# EAGLE board design (EAGLE 7.3.0), part 1 of 2
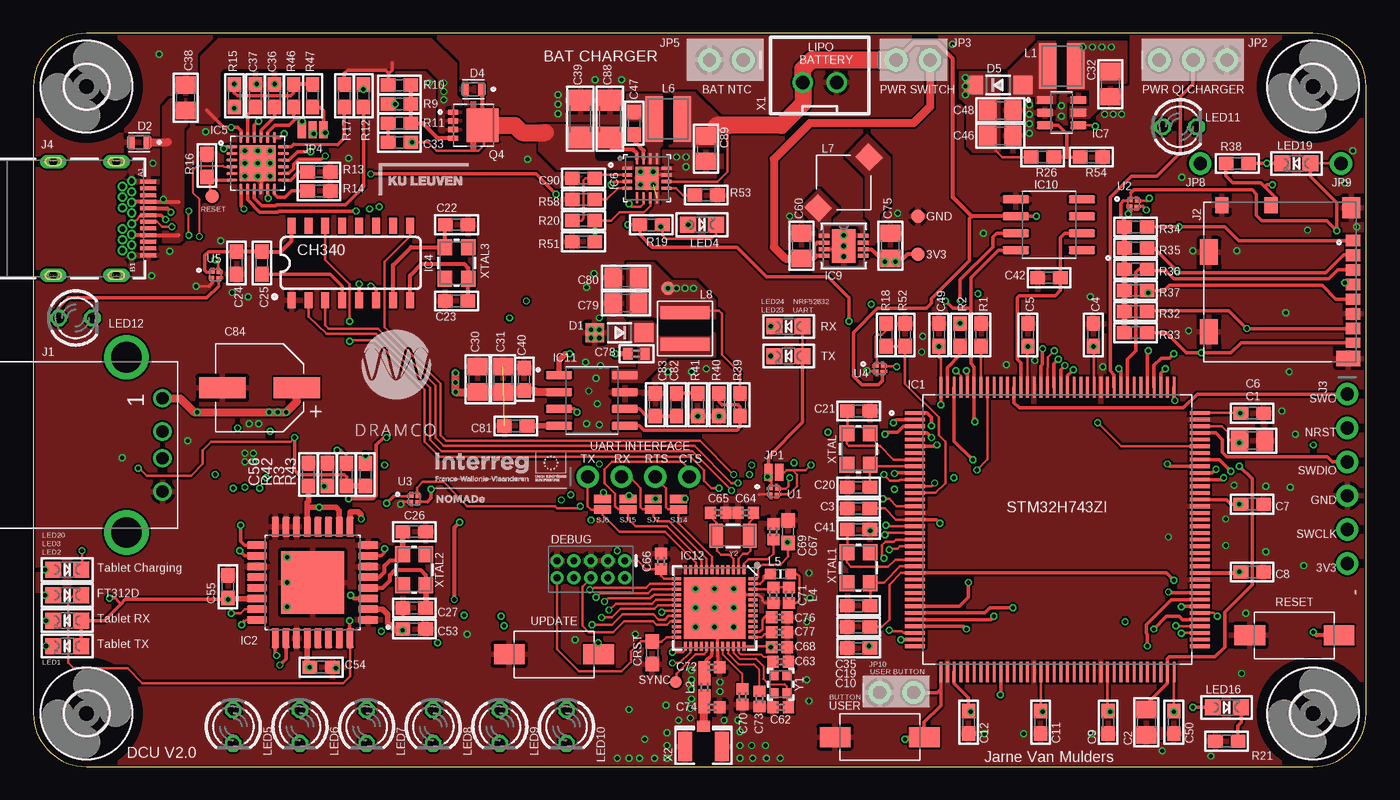
[diagram p7: board, top side]
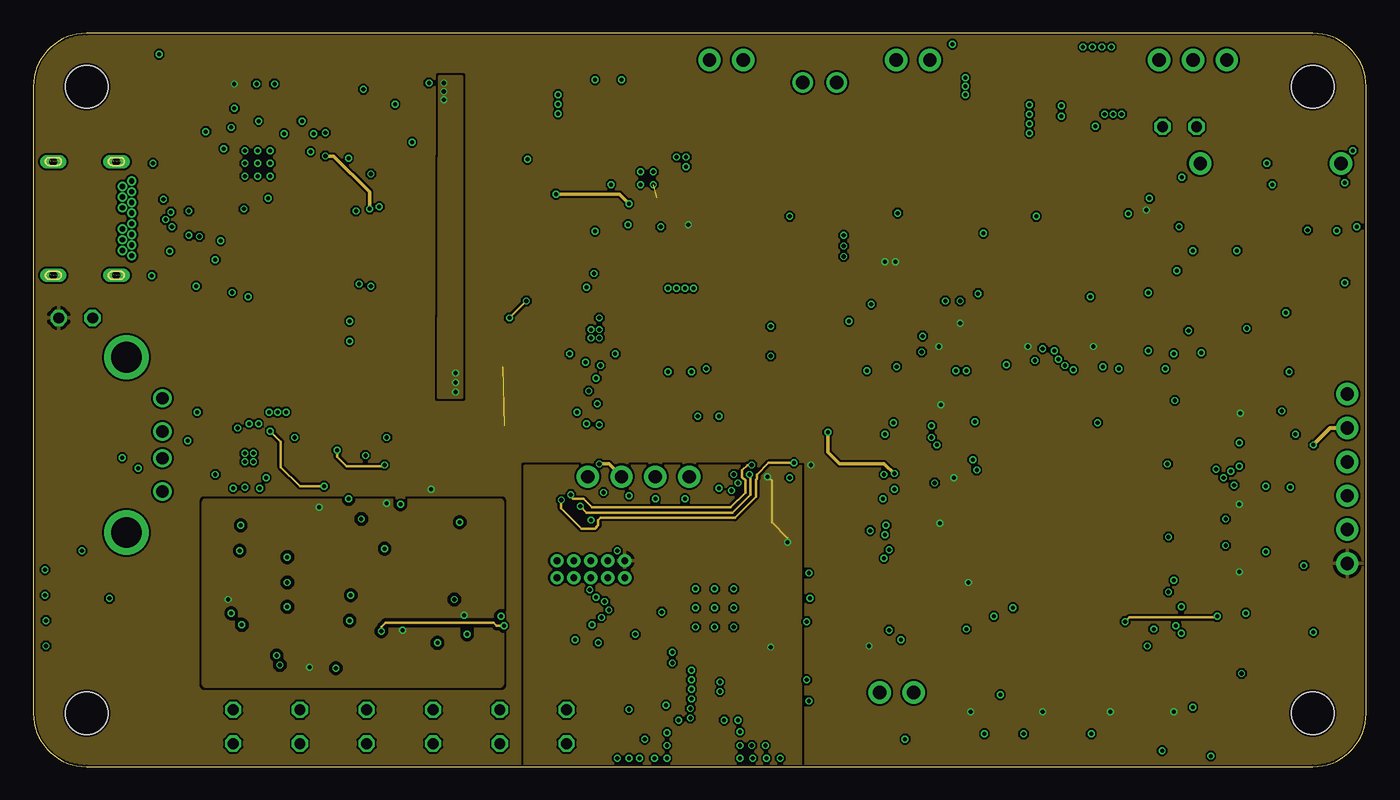
[diagram p8: board, inner layer Route2]
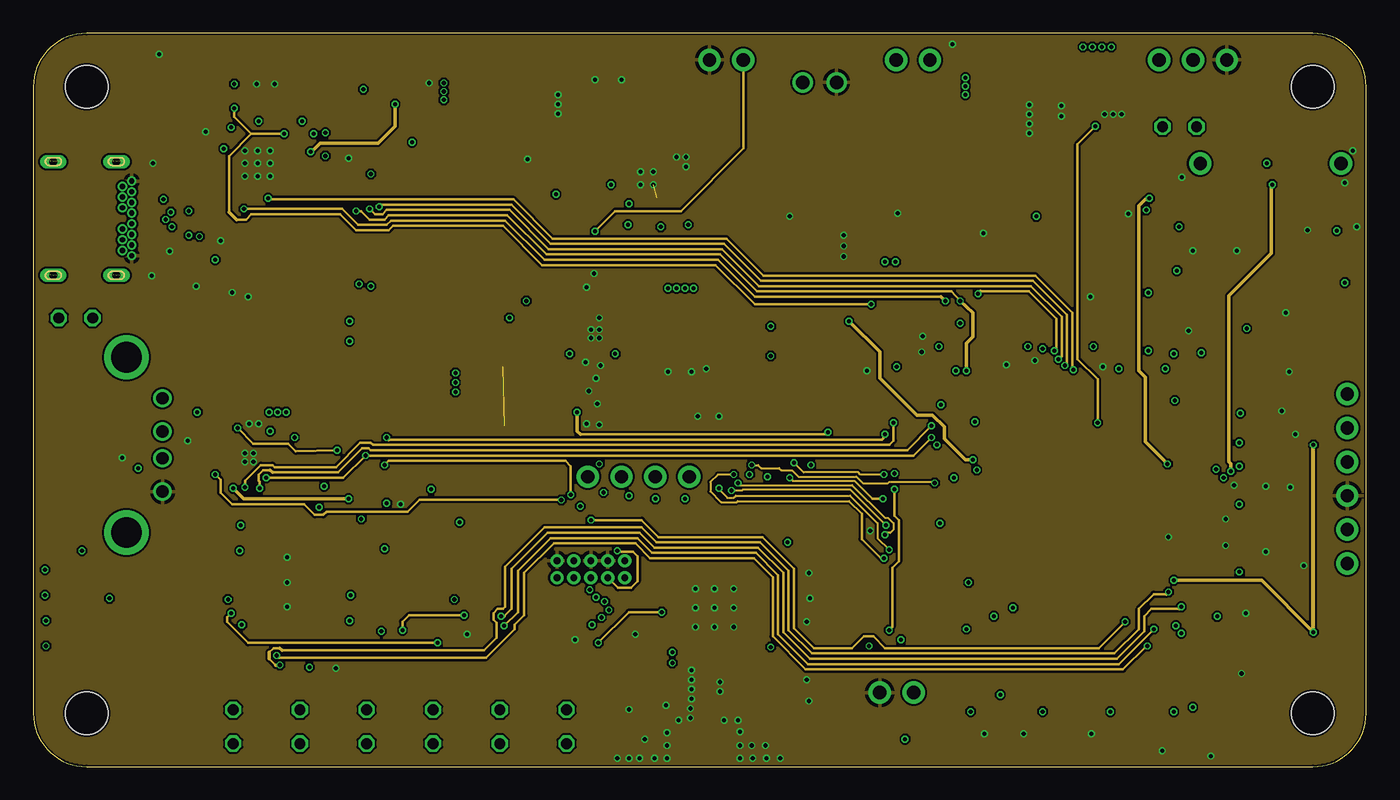
[diagram p9: board, inner layer Route3]
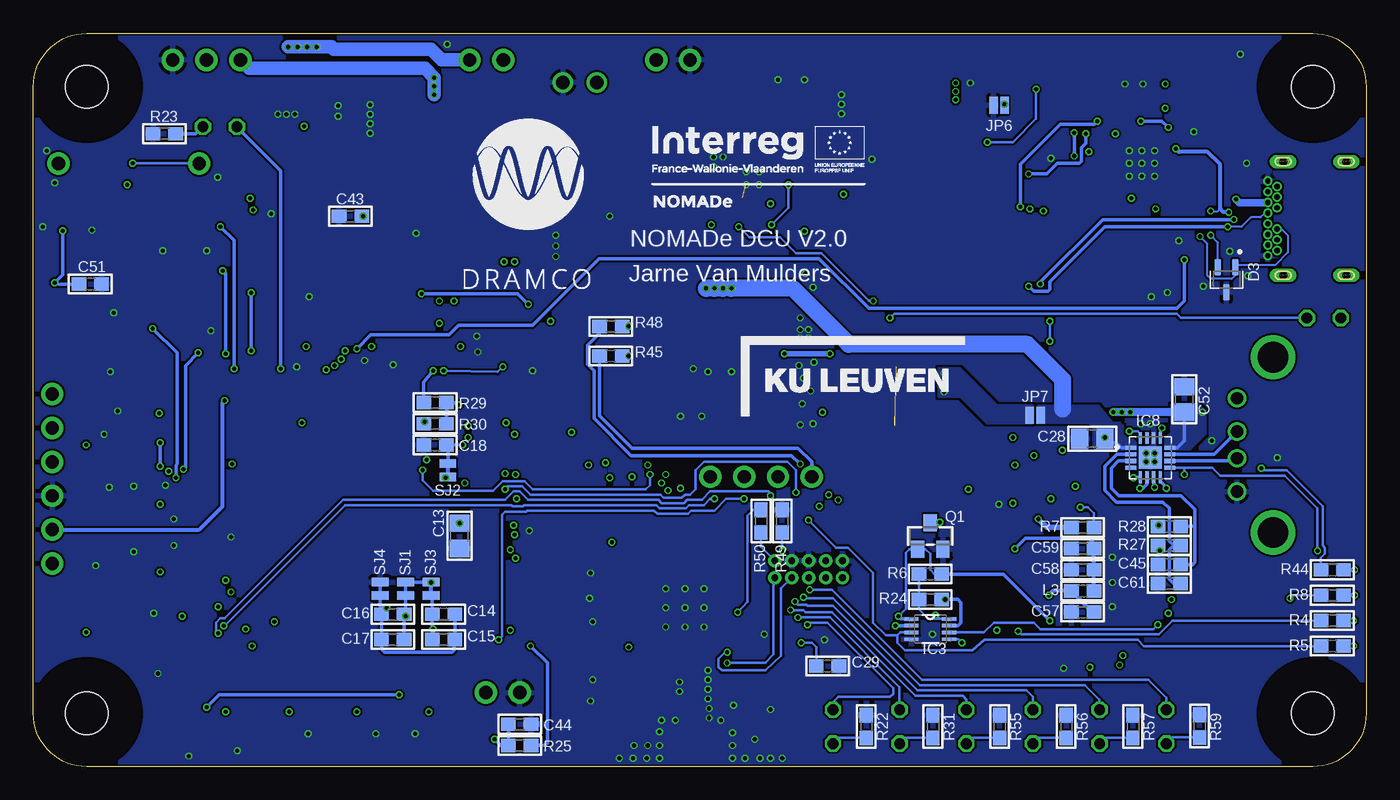
[diagram p10: board, bottom side, seen from below]

Size 100 x 55 mm. Coordinates in mm from the lower left corner, seen from the top.
Outline: 0,51 0,4 arc90 4,0 96,0 arc90 100,4 100,51 arc90 96,55 4,55 arc90 0,51
Copper layers (1*2*3*16): Top 0.035mm / dielectric 0.2mm / Route2 0.0175mm / dielectric 0.3mm / Route3 0.035mm / dielectric 0.2mm / Bottom 0.035mm
Design rules "SeeedStudio_4layer_DRU_no_angle_20140221 *": minimum track width 4mil, minimum drill 12mil, track to track 6mil, track to pad 6mil, pad to pad 3mil, via to via 6mil, smd to smd 0mil, copper to edge 4mil, drill to drill 8mil, minimum pad ring 6mil, minimum via ring 4mil, stop-mask expansion 4mil, vias tented up to drill 100mil, thermal gap 10mil

## Footprints (pad centres in the part's own frame; a part is rotated, then mirrored left to right if it is on the bottom)
0805 = smd 1.3 x 1.5: 1 -0.95,0; 2 0.95,0
0603 = smd 1.1 x 1: 1 -0.85,0; 2 0.85,0
1206 = smd 1.6 x 1.8: 1 -1.4,0; 2 1.4,0
0402 = smd 0.85 x 0.9: 1 -0.58,0; 2 0.58,0
0402' = smd 0.7 x 0.9: 1 -0.65,0; 2 0.65,0
3.5X1.6X2.1(BXCXA) = smd 3.5 x 1.6: 1 2.8,0; 2 -2.8,0
C0603 = smd 1.1 x 1: 1 -0.85,0; 2 0.85,0
SOD-123 = smd 1.4 x 1.4: A 1.85,0; C -1.85,0
TVS_ESDA25P35-1U1M = smd 0.55 x 0.8: A 0.625,0; C -0.625,0
SOT65P210X110-3N = smd 1.23 x 0.5: 1 -0.94,0.65; 2 -0.94,-0.65; 3 0.94,0
2X5-PTH-1.27MM = drill 0.508 pad 1: 1 -2.54,-0.635; 2 -2.54,0.635; 3 -1.27,-0.635; 4 -1.27,0.635; 5 0,-0.635; 6 0,0.635; 7 1.27,-0.635; 8 1.27,0.635; 9 2.54,-0.635; 10 2.54,0.635
3,2 = hole 3.2: 0,0
QFP50P2200X2200X160-144N = smd 1.56 x 0.28: 1 -10.68,8.75; 2 -10.68,8.25; 3 -10.68,7.75; 4 -10.68,7.25; 5 -10.68,6.75; 6 -10.68,6.25; 7 -10.68,5.75; 8 -10.68,5.25; 9 -10.68,4.75; 10 -10.68,4.25; 11 -10.68,3.75; 12 -10.68,3.25; 13 -10.68,2.75; 14 -10.68,2.25; 15 -10.68,1.75; 16 -10.68,1.25; 17 -10.68,0.75; 18 -10.68,0.25; 19 -10.68,-0.25; 20 -10.68,-0.75; 21 -10.68,-1.25; 22 -10.68,-1.75; 23 -10.68,-2.25; 24 -10.68,-2.75; 25 -10.68,-3.25; 26 -10.68,-3.75; 27 -10.68,-4.25; 28 -10.68,-4.75; 29 -10.68,-5.25; 30 -10.68,-5.75; 31 -10.68,-6.25; 32 -10.68,-6.75; 33 -10.68,-7.25; 34 -10.68,-7.75; 35 -10.68,-8.25; 36 -10.68,-8.75; 73 10.68,-8.75; 74 10.68,-8.25; 75 10.68,-7.75; 76 10.68,-7.25; 77 10.68,-6.75; 78 10.68,-6.25; 79 10.68,-5.75; 80 10.68,-5.25; 81 10.68,-4.75; 82 10.68,-4.25; 83 10.68,-3.75; 84 10.68,-3.25; 85 10.68,-2.75; 86 10.68,-2.25; 87 10.68,-1.75; 88 10.68,-1.25; 89 10.68,-0.75; 90 10.68,-0.25; 91 10.68,0.25; 92 10.68,0.75; 93 10.68,1.25; 94 10.68,1.75; 95 10.68,2.25; 96 10.68,2.75; 97 10.68,3.25; 98 10.68,3.75; 99 10.68,4.25; 100 10.68,4.75; 101 10.68,5.25; 102 10.68,5.75; 103 10.68,6.25; 104 10.68,6.75; 105 10.68,7.25; 106 10.68,7.75; 107 10.68,8.25; 108 10.68,8.75 | smd 0.28 x 1.56: 37 -8.75,-10.68; 38 -8.25,-10.68; 39 -7.75,-10.68; 40 -7.25,-10.68; 41 -6.75,-10.68; 42 -6.25,-10.68; 43 -5.75,-10.68; 44 -5.25,-10.68; 45 -4.75,-10.68; 46 -4.25,-10.68; 47 -3.75,-10.68; 48 -3.25,-10.68; 49 -2.75,-10.68; 50 -2.25,-10.68; 51 -1.75,-10.68; 52 -1.25,-10.68; 53 -0.75,-10.68; 54 -0.25,-10.68; 55 0.25,-10.68; 56 0.75,-10.68; 57 1.25,-10.68; 58 1.75,-10.68; 59 2.25,-10.68; 60 2.75,-10.68; 61 3.25,-10.68; 62 3.75,-10.68; 63 4.25,-10.68; 64 4.75,-10.68; 65 5.25,-10.68; 66 5.75,-10.68; 67 6.25,-10.68; 68 6.75,-10.68; 69 7.25,-10.68; 70 7.75,-10.68; 71 8.25,-10.68; 72 8.75,-10.68; 109 8.75,10.68; 110 8.25,10.68; 111 7.75,10.68; 112 7.25,10.68; 113 6.75,10.68; 114 6.25,10.68; 115 5.75,10.68; 116 5.25,10.68; 117 4.75,10.68; 118 4.25,10.68; 119 3.75,10.68; 120 3.25,10.68; 121 2.75,10.68; 122 2.25,10.68; 123 1.75,10.68; 124 1.25,10.68; 125 0.75,10.68; 126 0.25,10.68; 127 -0.25,10.68; 128 -0.75,10.68; 129 -1.25,10.68; 130 -1.75,10.68; 131 -2.25,10.68; 132 -2.75,10.68; 133 -3.25,10.68; 134 -3.75,10.68; 135 -4.25,10.68; 136 -4.75,10.68; 137 -5.25,10.68; 138 -5.75,10.68; 139 -6.25,10.68; 140 -6.75,10.68; 141 -7.25,10.68; 142 -7.75,10.68; 143 -8.25,10.68; 144 -8.75,10.68
QFP80P900X900X160-32N = smd 1.49 x 0.55: 1 -4.17,2.8; 2 -4.17,2; 3 -4.17,1.2; 4 -4.17,0.4; 5 -4.17,-0.4; 6 -4.17,-1.2; 7 -4.17,-2; 8 -4.17,-2.8; 17 4.17,-2.8; 18 4.17,-2; 19 4.17,-1.2; 20 4.17,-0.4; 21 4.17,0.4; 22 4.17,1.2; 23 4.17,2; 24 4.17,2.8 | smd 0.55 x 1.49: 9 -2.8,-4.17; 10 -2,-4.17; 11 -1.2,-4.17; 12 -0.4,-4.17; 13 0.4,-4.17; 14 1.2,-4.17; 15 2,-4.17; 16 2.8,-4.17; 25 2.8,4.17; 26 2,4.17; 27 1.2,4.17; 28 0.4,4.17; 29 -0.4,4.17; 30 -1.2,4.17; 31 -2,4.17; 32 -2.8,4.17 | smd 4.7 x 4.7: 33 0,0
SOP50P310X90-8N = smd 1.067 x 0.254: 1 -1.422,0.762; 2 -1.422,0.254; 3 -1.422,-0.254; 4 -1.422,-0.762; 5 1.422,-0.762; 6 1.422,-0.254; 7 1.422,0.254; 8 1.422,0.762
SO016 = smd 0.6 x 1.2: 1 -4.445,-2.8; 2 -3.175,-2.8; 3 -1.905,-2.8; 4 -0.635,-2.8; 5 0.635,-2.8; 6 1.905,-2.8; 7 3.175,-2.8; 8 4.445,-2.8; 9 4.445,2.8; 10 3.175,2.8; 11 1.905,2.8; 12 0.635,2.8; 13 -0.635,2.8; 14 -1.905,2.8; 15 -3.175,2.8; 16 -4.445,2.8
QFN50P400X400X90-25N = smd 0.84 x 0.26: 1 -1.93,1.25; 2 -1.93,0.75; 3 -1.93,0.25; 4 -1.93,-0.25; 5 -1.93,-0.75; 6 -1.93,-1.25; 13 1.93,-1.25; 14 1.93,-0.75; 15 1.93,-0.25; 16 1.93,0.25; 17 1.93,0.75; 18 1.93,1.25 | smd 0.26 x 0.84: 7 -1.25,-1.93; 8 -0.75,-1.93; 9 -0.25,-1.93; 10 0.25,-1.93; 11 0.75,-1.93; 12 1.25,-1.93; 19 1.25,1.93; 20 0.75,1.93; 21 0.25,1.93; 22 -0.25,1.93; 23 -0.75,1.93; 24 -1.25,1.93 | smd 2.7 x 2.7: 25 0,0
QFN50P350X350X100-21N = smd 0.8 x 0.23: 1 -1.475,0.75; 2 -1.475,0.25; 3 -1.475,-0.25; 4 -1.475,-0.75; 9 1.475,-0.75; 10 1.475,-0.25; 11 1.475,0.25; 12 1.475,0.75 | smd 0.23 x 0.8: 5 -0.75,-1.475; 6 -0.25,-1.475; 7 0.25,-1.475; 8 0.75,-1.475; 13 0.75,1.475; 14 0.25,1.475; 15 -0.25,1.475; 16 -0.75,1.475 | smd 1.7 x 1.7: 17 0,0
SOT95P280X145-6N = smd 1.21 x 0.58: 1 -1.255,0.95; 2 -1.255,0; 3 -1.255,-0.95; 4 1.255,-0.95; 5 1.255,0; 6 1.255,0.95
QFN50P300X300X80-17N = smd 0.83 x 0.26: 1 -1.47,0.75; 2 -1.47,0.25; 3 -1.47,-0.25; 4 -1.47,-0.75; 9 1.47,-0.75; 10 1.47,-0.25; 11 1.47,0.25; 12 1.47,0.75 | smd 0.26 x 0.83: 5 -0.75,-1.47; 6 -0.25,-1.47; 7 0.25,-1.47; 8 0.75,-1.47; 13 0.75,1.47; 14 0.25,1.47; 15 -0.25,1.47; 16 -0.75,1.47 | smd 1.7 x 1.7: 17 0,0
DFN-8_DD = smd 0.787 x 0.305: 1 -1.46,0.75; 2 -1.46,0.25; 3 -1.46,-0.25; 4 -1.46,-0.75; 5 1.46,-0.75; 6 1.46,-0.25; 7 1.46,0.25; 8 1.46,0.75 | smd 1.753 x 2.489: 9 0,0
SOIC127P600X175-8N = smd 1.97 x 0.59: 1 -2.475,1.905; 2 -2.475,0.635; 3 -2.475,-0.635; 4 -2.475,-1.905; 5 2.475,-1.905; 6 2.475,-0.635; 7 2.475,0.635; 8 2.475,1.905
SOIC127P599X175-8N = smd 1.97 x 0.6: 1 -2.47,1.905; 2 -2.47,0.635; 3 -2.47,-0.635; 4 -2.47,-1.905; 5 2.47,-1.905; 6 2.47,-0.635; 7 2.47,0.635; 8 2.47,1.905
QFN48-6X6MM = smd 0.68 x 0.23: 1 -2.86,2.2; 2 -2.86,1.8; 3 -2.86,1.4; 4 -2.86,1; 5 -2.86,0.6; 6 -2.86,0.2; 7 -2.86,-0.2; 8 -2.86,-0.6; 9 -2.86,-1; 10 -2.86,-1.4; 11 -2.86,-1.8; 12 -2.86,-2.2; 25 2.86,-2.2; 26 2.86,-1.8; 27 2.86,-1.4; 28 2.86,-1; 29 2.86,-0.6; 30 2.86,-0.2; 31 2.86,0.2; 32 2.86,0.6; 33 2.86,1; 34 2.86,1.4; 35 2.86,1.8; 36 2.86,2.2 | smd 0.23 x 0.68: 13 -2.2,-2.86; 14 -1.8,-2.86; 15 -1.4,-2.86; 16 -1,-2.86; 17 -0.6,-2.86; 18 -0.2,-2.86; 19 0.2,-2.86; 20 0.6,-2.86; 21 1,-2.86; 22 1.4,-2.86; 23 1.8,-2.86; 24 2.2,-2.86; 37 2.2,2.86; 38 1.8,2.86; 39 1.4,2.86; 40 1,2.86; 41 0.6,2.86; 42 0.2,2.86; 43 -0.2,2.86; 44 -0.6,2.86; 45 -1,2.86; 46 -1.4,2.86; 47 -1.8,2.86; 48 -2.2,2.86 | smd 4.6 x 4.6: EP 0,0
614004190021 = drill 0.92: 1 -3.5,2.71; 2 -1,2.71; 3 1,2.71; 4 3.5,2.71 | drill 2.3: SHELL -6.57,0; SHELL1 6.57,0
MOLEX_104031-0811 = smd 0.85 x 1.1: 1 3.105,-5.2; 3 0.905,-5.2; 4 -0.195,-5.2; 5 -1.295,-5.2; 6 -2.395,-5.2; 7 -3.495,-5.2 | smd 0.875 x 1.1: 2 2.005,-5.2 | smd 0.75 x 1.1: 8 -4.545,-5.2 | smd 1.2 x 1: 9 5.74,0.95; 10 5.74,4.65 | smd 1.55 x 1.35: G1 5.565,-5.075 | smd 1.17 x 1.8: G2 -5.755,-4.85 | smd 1.9 x 1.35: G3 -3.73,5.625; G4 2.24,5.625
1X06_ROUND = drill 1 pad 1.676: 1 -6.35,0; 2 -3.81,0; 3 -1.27,0; 4 1.27,0; 5 3.81,0; 6 6.35,0
632723100011 = smd 0.3 x 1.2: A1 -2.75,5.93; A2 -2.25,5.93; A3 -1.75,5.93; A4 -1.25,5.93; A5 -0.75,5.93; A6 -0.25,5.93; A7 0.25,5.93; A8 0.75,5.93; A9 1.25,5.93; A10 1.75,5.93; A11 2.25,5.93; A12 2.75,5.93 | drill 0.4 pad 0.65: B1 2.8,4.68; B2 2.4,3.98; B3 1.6,3.98; B4 1.2,4.68; B5 0.8,3.98; B6 0.4,4.68; B7 -0.4,4.68; B8 -0.8,3.98; B9 -1.2,4.68; B10 -1.6,3.98; B11 -2.4,3.98; B12 -2.8,4.68; GND 2,4.68; GND1 -2,4.68 | drill 0.6 pad 1 long: S1 -4.27,3.53; S2 4.27,3.53; S3 4.27,-1.2; S4 -4.27,-1.2
SMT-JUMPER_2_NO_NO-SILK = smd 0.635 x 1.27: 1 -0.406,0; 2 0.406,0
1X03_ROUND = drill 1 pad 1.676: 1 -2.54,0; 2 0,0; 3 2.54,0
1X02_ROUND = drill 1 pad 1.676: 1 -1.27,0; 2 1.27,0
SMT-JUMPER_3_NO_NO-SILK = smd 0.635 x 1.27: 1 -0.813,0; 2 0,0; 3 0.813,0
1X01_ROUND = drill 1 pad 1.676: 1 0,0
WE-MAIA_3020 = smd 1.3 x 3.4: 1 -1.05,0; 2 1.05,0
_0603MP = smd 0.8 x 0.8: 1 -0.762,0; 2 0.762,0
MSS4020 = smd 1.499 x 1.397 rotated 45: 1 -1.905,1.905; 2 1.905,-1.905
WE-MAIA_4030 = smd 0.98 x 3.7: 1 -1.185,0; 2 1.185,0
CHIPLED_0805 = smd 1.2 x 1.2: A 0,-1.05; C 0,1.05
LED3MM = drill 0.813 octagon: A -1.27,0; K 1.27,0
SOT23-WIDE = smd 1 x 1.27: 1 -0.95,-1; 2 0.95,-1; 3 0,1
TRANS_STL6P3LLH6 = smd 0.75 x 0.4: 1 -1.525,0.975; 2 -1.525,0.325; 3 -1.525,-0.325; 4 -1.525,-0.975 | smd 2.4 x 2.45: 5_8 0.7,0
434111043826 = smd 2.3 x 1.5: 1 -3.35,0; 2 3.35,0
SMT-JUMPER_2_NC_TRACE_NO-SILK = smd 0.635 x 1.27: 1 -0.508,0; 2 0.508,0
TP09R = smd 0.9 x 0.9: TP 0,0
TP10R = smd 1 x 1: TP 0,0
IC_MIC94081YFT-TR = smd 0.2 x 0.2: 1 -0.2,0.2; 2 -0.2,-0.2; 3 0.2,-0.2; 4 0.2,0.2
1X04_ROUND = drill 1 pad 1.676: 1 -3.81,0; 2 -1.27,0; 3 1.27,0; 4 3.81,0
JST-XH-02-PACKAGE-ROUND-PAD = drill 1.016: 1 -1.27,0; 2 1.27,0
U.FL = smd 2.2 x 1.05: 1 0,1.375; 2 0,-1.375 | smd 0.8 x 1: 3 1.525,0
CRYSTAL-SMD-3.2X2.5MM = smd 1.2 x 1.1: 1 -1.175,-0.875; 2 1.175,-0.875; 3 1.175,0.875; 4 -1.175,0.875
CRYSTAL-SMD-2.0X1.6MM = smd 0.75 x 0.7: 1 -0.675,-0.5; 2 0.675,-0.5; 3 0.675,0.5; 4 -0.675,0.5
CRYSTAL-SMD-3.2X1.5MM = smd 1 x 1.8: P$1 -1.25,0; P$2 1.25,0

## Placement (x,y rotation side)
C1  2u2  [0805]  91.44,24.45 0 top
C2  2u2  [0805]  83.5,3.33 270 top
C3  100n  [0603]  61.91,19.37 180 top
C4  100n  [0603]  79.53,32.38 90 top
C5  100n  [0603]  74.61,32.38 90 top
C6  100n  [0603]  91.44,26.51 0 top
C7  100n  [0603]  91.44,19.68 0 top
C8  100n  [0603]  91.44,14.61 0 top
C9  100n  [0603]  80.64,3.33 270 top
C10  100n  [0603]  61.91,8.89 180 top
C11  100n  [0603]  75.56,3.33 270 top
C12  100n  [0603]  70.17,3.33 270 top
C13  10u  [0805]  68.02,17.3 270 bottom
C14  1u  [0603]  69.22,11.43 0 bottom
C15  100n  [0603]  69.22,9.53 0 bottom
C16  1u  [0603]  73.03,11.43 180 bottom
C17  100n  [0603]  73.03,9.53 180 bottom
C18  1u  [0603]  69.85,24.13 180 bottom
C19  100n  [0603]  61.91,10.48 180 top
C20  15pF  [0603]  61.91,20.95 180 top
C21  15pF  [0603]  61.91,26.67 0 top
C22  22p  [0603]  31.75,40.64 0 top
C23  22p  [0603]  31.75,34.92 180 top
C24  100n  [0603]  15.24,37.78 270 top
C25  100n  [0603]  17.14,37.78 270 top
C26  22p  [0603]  28.57,17.62 0 top
C27  22p  [0603]  28.57,11.91 180 top
C28  10u  [0805]  20.56,24.61 180 bottom
C29  100n  [0603]  40.4,7.54 0 bottom
C30  10u  [0805]  33.34,29.05 90 top
C31  10u  [0805]  35.24,29.05 90 top
C32  10u  [0805]  80.8,51.2 270 top
C33  100n  [0603]  27.46,46.83 180 top
C35  [0603]  61.91,12.06 180 top
C36  1u  [0603]  18.1,50.32 90 top
C37  1u  [0603]  16.67,50.32 90 top
C38  1u  [0805]  11.43,50.16 90 top
C39  10u  [1206]  41.04,48.58 90 top
C40  100n  [0603]  36.83,29.05 90 top
C41  [0603]  61.91,17.78 0 top
C42  100n  [0603]  76.2,36.67 180 top
C43  100n  [0603]  76.2,41.27 0 bottom
C44  100n  [0603]  63.5,3.17 0 bottom
C45  47p  [0603]  14.76,15.16 180 bottom
C46  10u  [0805]  72.55,47.31 0 top
C47  47n  [0603]  45.09,48.26 270 top
C48  10u  [0805]  72.55,49.21 0 top
C49  100n  [0603]  67.94,32.38 90 top
C50  100n  [0603]  85.57,3.33 270 top
C51  100n  [0603]  95.73,36.2 0 bottom
C52  10u  [0805]  13.65,27.54 90 bottom
C53  100n  [0603]  28.57,10.32 0 top
C54  100n  [0603]  21.59,7.46 0 top
C55  100n  [0603]  14.61,13.49 90 top
C56  100n  [0603]  20.64,21.91 90 top
C57  100n  [0603]  21.27,11.59 180 bottom
C58  100n  [0603]  21.27,14.76 180 bottom
C59  4u7  [0603]  21.27,16.35 180 bottom
C60  10u  [0805]  57.63,39.05 90 top
C61  47p  [0603]  14.76,13.73 180 bottom
C62  6pF  [0402]  56.07,4.45 0 top
C63  6pF  [0402]  56.07,7.86 0 top
C64  15pF  [0402]  53.45,19.05 0 top
C65  15pF  [0402]  51.39,19.05 180 top
C66  0.1uF  [0402]  47.1,15.4 90 top
C67  4.7uF  [0603]  56.63,17.62 90 top
C68  0.1uF  [0402]  55.99,8.97 0 top
C69  0.1uF  [0402]  55.52,17.62 270 top
C70  DNP  [0402]  53.21,5.24 90 top
C71  1.0uF  [0402]  55.52,12.86 90 top
C72  0.8pF  [0402]  50.91,7.46 180 top
C73  100pF  [0402]  54.48,5.08 90 top
C74  DNP  [0402]  50.91,4.45 0 top
C75  10u  [0805]  64.29,39.05 90 top
C76  12p  [0402]  55.99,11.19 180 top
C77  12p  [0402]  55.99,10.08 180 top
C78  100n  [0402']  45.24,30.96 180 top
C79  22u  [0805]  44.45,34.77 180 top
C80  22u  [0805]  44.45,36.67 180 top
C81  100n  [0603]  36.2,25.56 180 top
C82  1n  [0603]  48.26,27.15 90 top
C83  47p  [0603]  46.67,27.15 90 top
C84  150uF  [3.5X1.6X2.1(BXCXA)]  16.99,28.42 0 top
C88  10u  [1206]  43.26,48.58 90 top
C89  10u  [0805]  50.48,46.35 270 top
C90  2u2  [0603]  41.27,44.13 180 top
CRST  100n  [C0603]  46.43,8.54 270 top
D1  PMEG3020EGWX  [SOD-123]  43.97,32.54 180 top
D2  ESDA25P35-1U1M  [TVS_ESDA25P35-1U1M]  7.94,46.83 180 top
D3  ESDA25W  [SOT65P210X110-3N]  10.48,36.51 270 bottom
D4  ESDA25P35-1U1M  [TVS_ESDA25P35-1U1M]  33.02,50.8 180 top
D5  PMEG3020EGWX  [SOD-123]  72.39,51.12 0 top
DEBUG  CORTEX_DEBUGPTH  [2X5-PTH-1.27MM]  41.83,14.8 180 top
H1  MOUNT-HOLE3.2  [3,2]  4,4 0 top
H2  MOUNT-HOLE3.2  [3,2]  96,4 0 top
H3  MOUNT-HOLE3.2  [3,2]  96,51 0 top
H4  MOUNT-HOLE3.2  [3,2]  4,51 0 top
IC1  STM32H743ZIT6  [QFP50P2200X2200X160-144N]  76.83,17.78 0 top
IC2  FT312D  [QFP80P900X900X160-32N]  20.95,13.81 180 top
IC3  SN74LVC2G241DCUT  [SOP50P310X90-8N]  32.7,10.32 0 bottom
IC4  CH340G  [SO016]  23.81,37.78 0 top
IC5  STUSB4500QTR  [QFN50P400X400X90-25N]  16.83,45.24 0 top
IC6  BQ25300  [QFN50P350X350X100-21N]  46.04,44.13 0 top
IC7  TLV61048DBVT  [SOT95P280X145-6N]  77.15,49.05 0 top
IC8  STCC2540  [QFN50P300X300X80-17N]  16.19,23.18 0 bottom
IC9  LTC3531EDDPBF  [DFN-8_DD]  60.8,39.05 0 top
IC10  DS3231MZ+TRL  [SOIC127P600X175-8N]  76.2,40.64 180 top
IC11  TPS54331D  [SOIC127P599X175-8N]  41.91,27.46 0 top
IC12  NRF52832  [QFN48-6X6MM]  51.12,11.91 270 top
J1  [614004190021]  6.99,24.13 270 top
J2  104031-0811  [MOLEX_104031-0811]  93.82,36.35 90 top
J3  SWD  [1X06_ROUND]  98.58,21.59 270 top
J4  632723100011  [632723100011]  2.7,41.12 270 top
JP1  JUMPER-SMT_2_NO_NO-SILK  [SMT-JUMPER_2_NO_NO-SILK]  55.56,22.07 180 top
JP2  [1X03_ROUND]  87,53 0 top
JP3  [1X02_ROUND]  66,53 0 top
JP4  JUMPER-SMT_3_NO_NO-SILK  [SMT-JUMPER_3_NO_NO-SILK]  20.95,47.78 180 top
JP5  [1X02_ROUND]  52,53 180 top
JP6  JUMPER-SMT_2_NO_NO-SILK  [SMT-JUMPER_2_NO_NO-SILK]  27.54,49.61 180 bottom
JP7  JUMPER-SMT_2_NO_NO-SILK  [SMT-JUMPER_2_NO_NO-SILK]  24.84,26.35 0 bottom
JP8  [1X01_ROUND]  87.55,45.24 0 top
JP9  [1X01_ROUND]  98.11,45.24 0 top
JP10  [1X02_ROUND]  64.77,5.56 0 top
L1  2u2  [WE-MAIA_3020]  77.15,52.55 180 top
L2  3.9nH  [0402]  50.36,5.95 90 top
L3  600  [0603]  21.27,13.18 180 bottom
L4  15nH  [0402]  56.71,12.86 90 top
L5  10uH  [_0603MP]  56.07,14.45 0 top
L6  2u2  [WE-MAIA_3020]  47.62,48.58 0 top
L7  10uH  [MSS4020]  60.8,43.81 90 top
L8  10u  [WE-MAIA_4030]  48.9,32.86 90 top
LED1  [CHIPLED_0805]  2.54,9.05 90 top
LED2  [CHIPLED_0805]  2.54,10.95 90 top
LED3  GREEN  [CHIPLED_0805]  2.54,12.86 270 top
LED4  [CHIPLED_0805]  50.16,40.64 270 top
LED5  [LED3MM]  15,3 270 top
LED6  [LED3MM]  20,3 270 top
LED7  [LED3MM]  25,3 270 top
LED8  [LED3MM]  30,3 270 top
LED9  [LED3MM]  35,3 270 top
LED10  [LED3MM]  40,3 270 top
LED11  [LED3MM]  86,48 0 top
LED12  [LED3MM]  3.17,33.66 0 top
LED16  [CHIPLED_0805]  89.53,4.45 270 top
LED19  RED  [CHIPLED_0805]  94.77,45.24 90 top
LED20  GREEN  [CHIPLED_0805]  2.54,14.76 270 top
LED23  RED  [CHIPLED_0805]  56.67,30.8 90 top
LED24  RED  [CHIPLED_0805]  56.67,33.02 90 top
Q1  2N7002  [SOT23-WIDE]  32.7,17.3 0 bottom
Q4  STL6P3LLH6  [TRANS_STL6P3LLH6]  33.02,48.1 0 top
R1  10k  [0603]  71.12,32.38 270 top
R2  10k  [0603]  69.53,32.38 90 top
R3  10k  [0603]  23.5,21.91 270 top
R4  470  [0603]  2.54,10.95 0 bottom
R5  470  [0603]  2.54,9.05 0 bottom
R6  10k  [0603]  32.7,14.45 180 bottom
R7  10k  [0603]  21.27,17.94 0 bottom
R8  470  [0603]  2.54,12.86 180 bottom
R9  22k  [0603]  27.46,49.69 0 top
R10  100k  [0603]  27.46,51.12 180 top
R11  100  [0603]  27.46,48.26 0 top
R12  1k  [0603]  24.77,50.32 270 top
R13  100k  [0603]  21.43,44.61 0 top
R14  100k  [0603]  21.43,43.18 0 top
R15  4k7  [0603]  15.08,50.32 270 top
R16  100k  [0603]  13.02,45.09 270 top
R17  1k  [0603]  23.34,50.32 270 top
R18  100k  [0603]  63.98,32.38 270 top
R19  1k  [0603]  46.35,40.64 180 top
R20  10k  [0603]  41.27,40.96 0 top
R21  470  [0603]  89.53,1.91 0 top
R22  470  [0603]  37.5,3 270 bottom
R23  470  [0603]  90.17,47.47 0 bottom
R24  10k  [0603]  32.7,12.54 180 bottom
R25  10k  [0603]  63.5,1.59 0 bottom
R26  180k  [0603]  75.72,45.72 0 top
R27  27  [0603]  14.76,16.59 180 bottom
R28  27  [0603]  14.76,18.02 180 bottom
R29  4k7  [0603]  69.85,27.3 0 bottom
R30  4k7  [0603]  69.85,25.72 0 bottom
R31  470  [0603]  32.5,3 270 bottom
R32  10k  [0603]  82.71,34.13 0 top
R33  10k  [0603]  82.71,32.54 0 top
R34  10k  [0603]  82.71,40.48 0 top
R35  10k  [0603]  82.71,38.89 0 top
R36  10k  [0603]  82.71,37.31 0 top
R37  10k  [0603]  82.71,35.72 0 top
R38  470  [0603]  90.33,45.24 0 top
R39  560k  [0603]  53.02,27.15 90 top
R40  100k  [0603]  51.44,27.15 90 top
R41  29.4k  [0603]  49.85,27.15 90 top
R42  33k  [0603]  22.07,21.91 270 top
R43  10k  [0603]  24.92,21.91 270 top
R44  470  [0603]  2.54,14.76 180 bottom
R45  470  [0603]  56.67,30.8 0 bottom
R46  100k  [0603]  19.53,50.32 90 top
R47  100k  [0603]  20.95,50.32 90 top
R48  470  [0603]  56.67,33.02 0 bottom
R49  10k  [0603]  43.81,18.41 270 bottom
R50  10k  [0603]  45.4,18.41 270 bottom
R51  10k  [0603]  41.27,39.37 180 top
R52  10k  [0603]  65.41,32.38 90 top
R53  10k  [0603]  50.48,42.86 0 top
R54  33k  [0603]  79.38,45.72 0 top
R55  470  [0603]  27.5,3 270 bottom
R56  470  [0603]  22.5,3 270 bottom
R57  470  [0603]  17.5,3 270 bottom
R58  18k  [0603]  41.27,42.55 180 top
R59  470  [0603]  12.5,3.04 270 bottom
RESET  [434111043826]  94.61,9.84 0 top
SJ1  JUMPER-SMT_2_NC_TRACE_NO-SILK  [SMT-JUMPER_2_NC_TRACE_NO-SILK]  72.07,13.34 90 bottom
SJ2  JUMPER-SMT_2_NC_TRACE_NO-SILK  [SMT-JUMPER_2_NC_TRACE_NO-SILK]  68.9,22.23 270 bottom
SJ3  JUMPER-SMT_2_NC_TRACE_NO-SILK  [SMT-JUMPER_2_NC_TRACE_NO-SILK]  70.17,13.34 90 bottom
SJ4  JUMPER-SMT_2_NC_TRACE_NO-SILK  [SMT-JUMPER_2_NC_TRACE_NO-SILK]  73.98,13.34 270 bottom
SJ6  JUMPER-SMT_2_NO_NO-SILK  [SMT-JUMPER_2_NO_NO-SILK]  42.7,19.68 270 top
SJ7  JUMPER-SMT_2_NO_NO-SILK  [SMT-JUMPER_2_NO_NO-SILK]  46.51,19.68 270 top
SJ14  JUMPER-SMT_2_NO_NO-SILK  [SMT-JUMPER_2_NO_NO-SILK]  48.42,19.68 270 top
SJ15  JUMPER-SMT_2_NO_NO-SILK  [SMT-JUMPER_2_NO_NO-SILK]  44.61,19.68 270 top
SYNC  TPTP09R  [TP09R]  48.21,6.35 180 top
TP1  TPTP10R  [TP10R]  13.41,42.78 0 top
TP2  TPTP10R  [TP10R]  47.62,35.88 0 top
TP3  TPTP10R  [TP10R]  66.36,38.42 0 top
TP4  TPTP10R  [TP10R]  66.36,41.27 0 top
U1  MIC94081YFT-TR  [IC_MIC94081YFT-TR]  55.56,20.64 0 top
U2  MIC94081YFT-TR  [IC_MIC94081YFT-TR]  82.55,42.23 0 top
U3  MIC94081YFT-TR  [IC_MIC94081YFT-TR]  28.57,20.08 0 top
U4  MIC94081YFT-TR  [IC_MIC94081YFT-TR]  63.5,29.84 0 top
U5  MIC94081YFT-TR  [IC_MIC94081YFT-TR]  13.67,36.88 0 top
UART_INTERFACE  [1X04_ROUND]  45.4,21.75 0 top
UPDATE  [434111043826]  39.05,8.41 0 top
USER  [434111043826]  63.5,2.22 0 top
X1  JST-XH-02-PIN-ROUND-PAD  [JST-XH-02-PACKAGE-ROUND-PAD]  59,51.32 0 top
X2  [U.FL]  50.28,1.51 90 top
XTAL  [CRYSTAL-SMD-3.2X2.5MM]  61.91,23.81 270 top
XTAL1  [CRYSTAL-SMD-3.2X2.5MM]  61.91,14.92 270 top
XTAL2  12MHz  [CRYSTAL-SMD-3.2X2.5MM]  28.57,14.76 270 top
XTAL3  12MHz  [CRYSTAL-SMD-3.2X2.5MM]  31.75,37.78 270 top
Y1  32MHz  [CRYSTAL-SMD-2.0X1.6MM]  56.07,6.19 270 top
Y2  32.768kHz  [CRYSTAL-SMD-3.2X1.5MM]  52.5,17.3 0 top